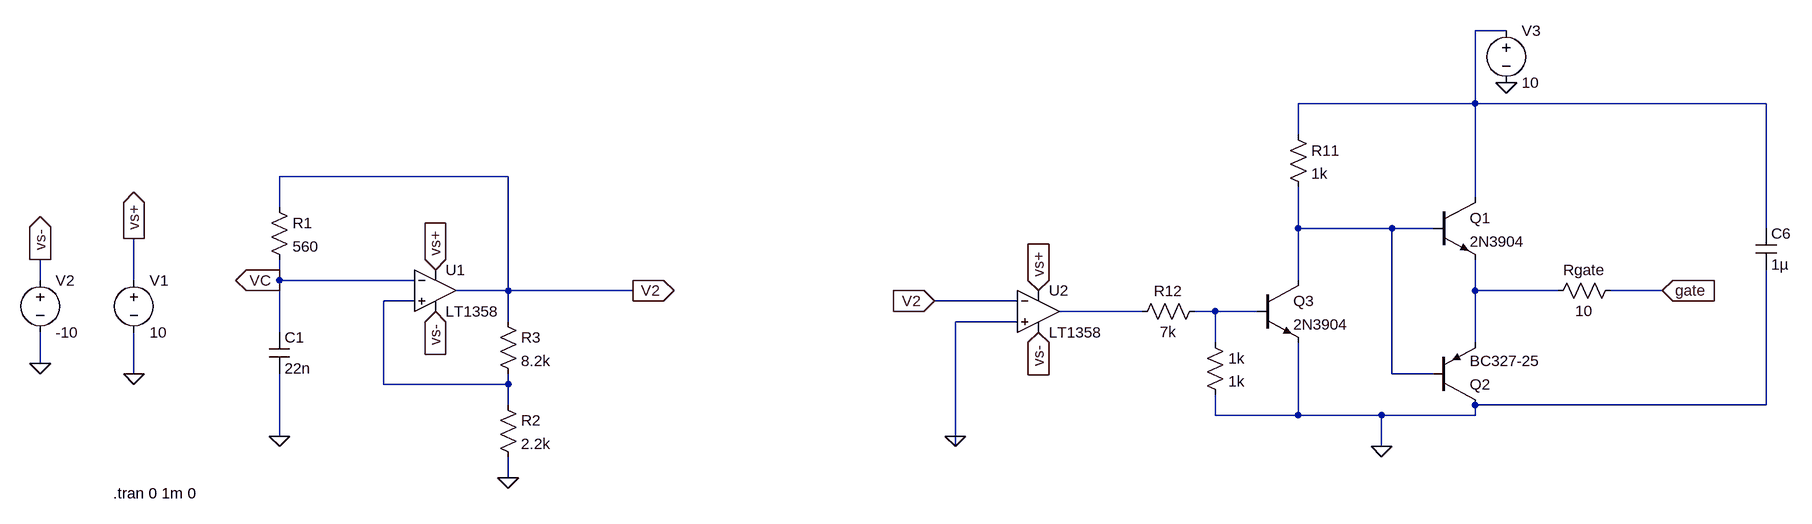
[diagram p0: schematic updatedSchmidt1011.asc]
updatedSchmidt1011.asc, the LTspice schematic file:
Version 4
SHEET 1 2268 680
WIRE 1616 -384 1568 -384
WIRE 1568 -272 1568 -384
WIRE 1568 -272 1296 -272
WIRE 2016 -272 1568 -272
WIRE 1296 -224 1296 -272
WIRE 80 -160 -272 -160
WIRE 1568 -128 1568 -272
WIRE -272 -112 -272 -160
WIRE 1296 -80 1296 -144
WIRE 1440 -80 1296 -80
WIRE 1504 -80 1440 -80
WIRE 2016 -80 2016 -272
WIRE -640 0 -640 -32
WIRE -496 0 -496 -64
WIRE -272 0 -272 -32
WIRE -64 0 -272 0
WIRE 1296 0 1296 -80
WIRE 80 16 80 -160
WIRE 80 16 0 16
WIRE 272 16 80 16
WIRE 1568 16 1568 -32
WIRE 1696 16 1568 16
WIRE 1856 16 1776 16
WIRE -64 32 -112 32
WIRE 864 32 736 32
WIRE 1056 48 928 48
WIRE 1168 48 1136 48
WIRE 1232 48 1168 48
WIRE 80 64 80 16
WIRE 864 64 768 64
WIRE -272 80 -272 0
WIRE 1168 96 1168 48
WIRE 1568 96 1568 16
WIRE -640 128 -640 80
WIRE -496 144 -496 80
WIRE 1440 144 1440 -80
WIRE 1504 144 1440 144
WIRE -112 160 -112 32
WIRE 80 160 80 144
WIRE 80 160 -112 160
WIRE 80 192 80 160
WIRE 2016 192 2016 -16
WIRE 2016 192 1568 192
WIRE 1168 208 1168 176
WIRE 1296 208 1296 96
WIRE 1296 208 1168 208
WIRE 1424 208 1296 208
WIRE 1568 208 1568 192
WIRE 1568 208 1424 208
WIRE -272 240 -272 144
WIRE 768 240 768 64
WIRE 768 256 768 240
WIRE 1424 256 1424 208
WIRE 80 304 80 272
FLAG 80 304 0
FLAG -272 240 0
FLAG 272 16 V2
IOPIN 272 16 Out
FLAG -496 144 0
FLAG -640 128 0
FLAG 736 32 V2
IOPIN 736 32 In
FLAG 768 240 0
FLAG -496 -64 vs+
IOPIN -496 -64 Out
FLAG -640 -32 vs-
IOPIN -640 -32 Out
FLAG -32 -16 vs+
IOPIN -32 -16 In
FLAG 896 16 vs+
IOPIN 896 16 In
FLAG -32 48 vs-
IOPIN -32 48 In
FLAG 896 80 vs-
IOPIN 896 80 In
FLAG 1856 16 gate
IOPIN 1856 16 In
FLAG 1424 256 0
FLAG 1616 -304 0
FLAG -272 0 VC
IOPIN -272 0 Out
DATAFLAG 1904 16 ""
DATAFLAG -304 0 ""
SYMBOL cap -288 80 R0
SYMATTR InstName C1
SYMATTR Value 22n
SYMBOL res -288 -128 R0
SYMATTR InstName R1
SYMATTR Value 560
SYMBOL Opamps\\LT1358 -32 -48 R0
SYMATTR InstName U1
SYMBOL res 64 48 R0
SYMATTR InstName R3
SYMATTR Value 8.2k
SYMBOL res 64 176 R0
SYMATTR InstName R2
SYMATTR Value 2.2k
SYMBOL voltage -496 -16 R0
WINDOW 123 0 0 Left 0
WINDOW 39 0 0 Left 0
SYMATTR InstName V1
SYMATTR Value 10
SYMBOL voltage -640 -16 R0
WINDOW 123 0 0 Left 0
WINDOW 39 0 0 Left 0
SYMATTR InstName V2
SYMATTR Value -10
SYMBOL Opamps\\LT1358 896 -16 R0
SYMATTR InstName U2
SYMBOL res 1152 32 R90
WINDOW 0 0 56 VBottom 2
WINDOW 3 32 56 VTop 2
SYMATTR InstName R12
SYMATTR Value 7k
SYMBOL res 1152 80 R0
SYMATTR InstName 1k
SYMATTR Value 1k
SYMBOL npn 1232 0 R0
SYMATTR InstName Q3
SYMATTR Value 2N3904
SYMBOL res 1280 -240 R0
SYMATTR InstName R11
SYMATTR Value 1k
SYMBOL res 1792 0 R90
WINDOW 0 0 56 VBottom 2
WINDOW 3 32 56 VTop 2
SYMATTR InstName Rgate
SYMATTR Value 10
SYMBOL cap 2000 -80 R0
SYMATTR InstName C6
SYMATTR Value 1µ
SYMBOL pnp 1504 192 M180
SYMATTR InstName Q2
SYMATTR Value BC327-25
SYMBOL voltage 1616 -400 R0
WINDOW 123 0 0 Left 0
WINDOW 39 0 0 Left 0
SYMATTR InstName V3
SYMATTR Value 10
SYMBOL npn 1504 -128 R0
SYMATTR InstName Q1
SYMATTR Value 2N3904
TEXT -528 328 Left 2 !.tran 0 1m 0

The netlist it stands for:
* updatedSchmidt1011.asc
C1 VC 0 22n
R1 V2 VC 560
XU1 N004 VC vs+ vs- V2 LT1357  ; LT1358, pins In+ In- V+ V- OUT
R3 V2 N004 8.2k
R2 N004 0 2.2k
V1 vs+ 0 10
V2 vs- 0 -10
XU2 0 V2 vs+ vs- N005 LT1357  ; LT1358, pins In+ In- V+ V- OUT
R12 N006 N005 7k
R§1k N006 0 1k
Q3 N002 N006 0 0 2N3904
R11 N001 N002 1k
Rgate gate N003 10
C6 N001 0 1µ
Q2 0 N002 N003 0 BC327-25
V3 N001 0 10
Q1 N001 N002 N003 0 2N3904
.model NPN NPN
.model PNP PNP
.lib standard.bjt
.tran 0 1m 0
.lib LTC.lib
.backanno
.end